# Altium schematic sheet Top Level.SchDoc
size Tabloid; Author: Arash Ghaderi; SheetNumber: 1; SheetTotal: 9; PageSetup: Record=PageOptions|CenterHorizontal=True|CenterVertical=True|PrintScale=1.00|XCorrection=1.00|YCorrection=1.00|PrintKind=1|BorderSize=5000000|LeftOffset=0|BottomOffset=0|Orientation=2|PaperLength=1000|PaperWidth=1000|Scale=100|PaperSource=7|PrintQuality=-4|MediaType=1|DitherType=10|PaperKind=Ledger|PrintScaleMode=1; cpr-ItemNumber: 025619; cpr-ItemName1: TURTLEBOT4  UI Board; cpr-ItemName2: Rev 2; cpr-Revision: 2; cpr-SheetNumber: 1; cpr-SheetTotal: 9; cpr-Draft: XXX; cpr-DraftDate: 19/04/2022; cpr-Rigour1: X; cpr-Rigour2: X; cpr-Rigour1Date: X; cpr-Rigour2Date: X
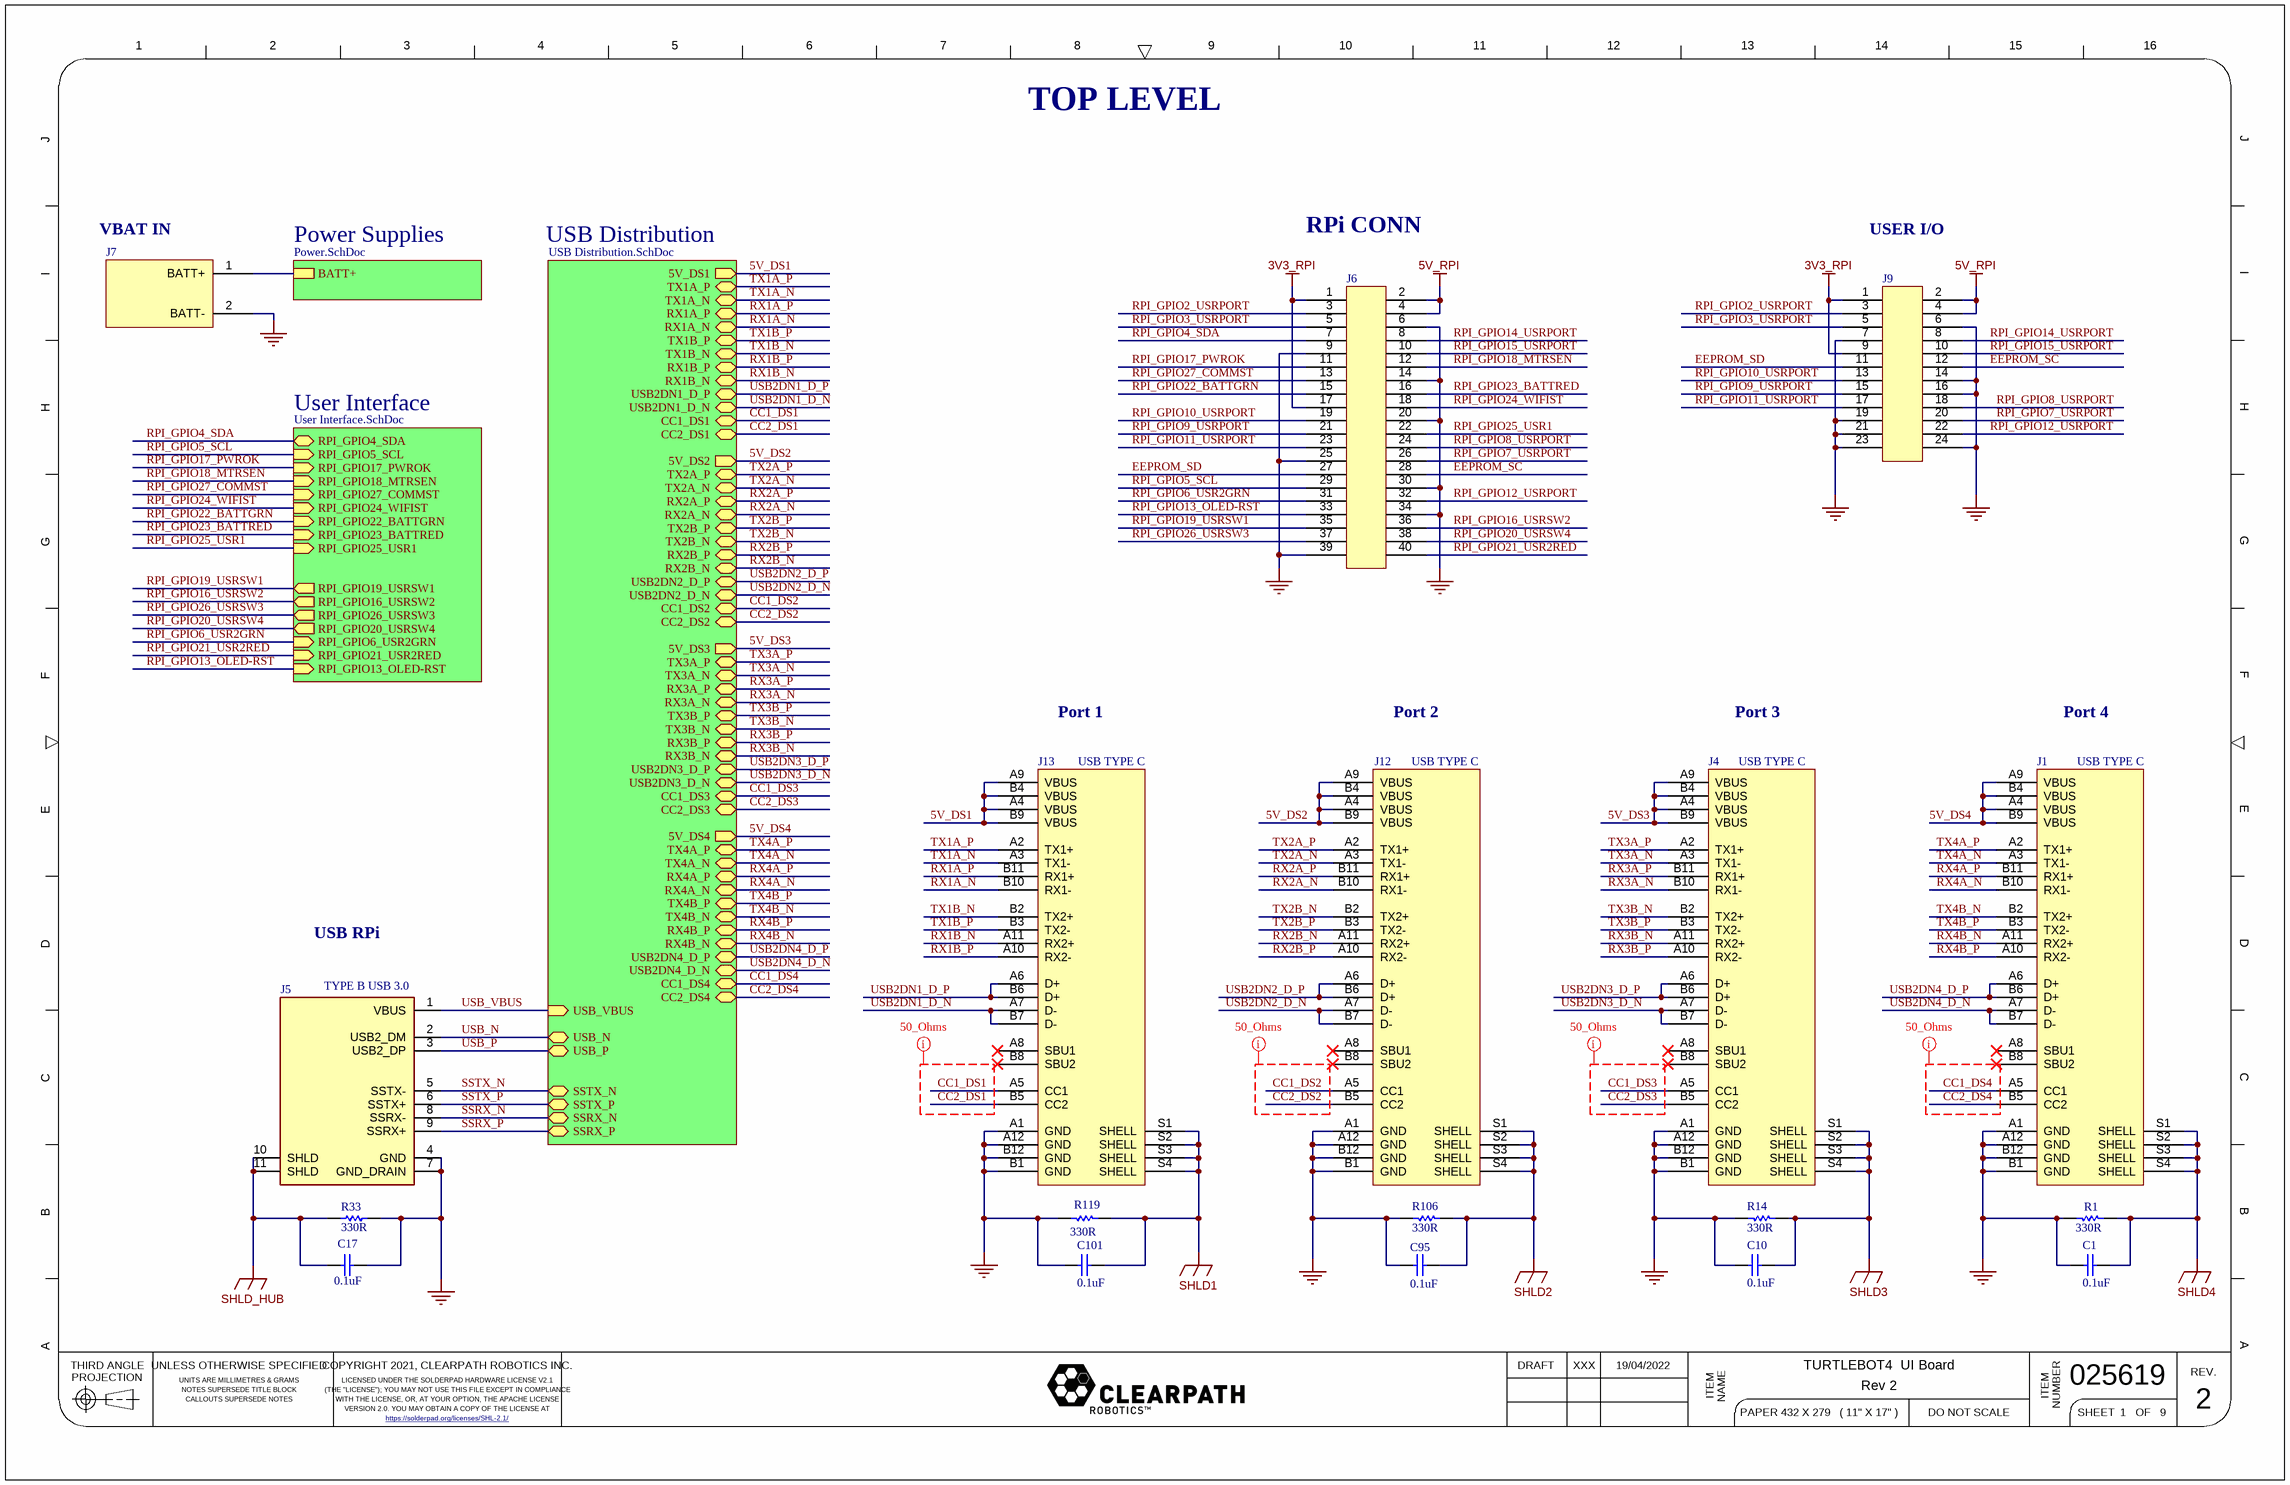
[diagram p0: Top Level.SchDoc]

## Parts
C1  value 0.1uF  [C0805]  (hidden comment: Capacitor _SMT)
C10  value 0.1uF  [C0805]  (hidden comment: Capacitor _SMT)
C17  value 0.1uF  [C0805]  (hidden comment: Capacitor _SMT)
C95  value 0.1uF  [C0805]  (hidden comment: Capacitor _SMT)
C101  value 0.1uF  [C0805]  (hidden comment: Capacitor _SMT)
J1  USB TYPE C  [MOLEX_2012670005]
J4  USB TYPE C  [MOLEX_2012670005]
J5  TYPE B USB 3.0  [1003-024-02000]
J6  Conn_2X20_2  [Conn_2X20_SMT]  (value not drawn)
J7  JST Power Connector  [JST_S2B]  (value not drawn)
J9  AUX_CONNECTOR  [SULLINS_SBH11-NBPC-D12-SM-BK]  (value not drawn)
J12  USB TYPE C  [MOLEX_2012670005]
J13  USB TYPE C  [MOLEX_2012670005]
R1  value 330R  [R0805]  (hidden comment: Resistor_SMT)
R14  value 330R  [R0805]  (hidden comment: Resistor_SMT)
R33  value 330R  [R0805]  (hidden comment: Resistor_SMT)
R106  value 330R  [R0805]  (hidden comment: Resistor_SMT)
R119  value 330R  [R0805]  (hidden comment: Resistor_SMT)

## Sub-sheets
Power Supplies = Power.SchDoc: BATT+
USB Distribution = USB Distribution.SchDoc: RX1A_N (bidir), TX1B_N (bidir), TX1B_P (bidir), CC2_DS1 (bidir), CC1_DS1 (bidir), TX1A_N (bidir), 5V_DS1 (out), TX1A_P (bidir), USB2DN1_D_N (bidir), RX1B_P (bidir), RX1B_N (bidir), RX1A_P (bidir), USB2DN1_D_P (bidir), SSTX_P (bidir), USB_P (bidir), USB_N (bidir), USB_VBUS (in), SSRX_P (bidir), SSRX_N (bidir), SSTX_N (bidir), TX3A_P (bidir), CC1_DS4 (bidir), 5V_DS4 (out), RX2B_N (bidir), TX3B_N (bidir), RX4B_N (bidir), RX2A_N (bidir), USB2DN2_D_P (bidir), USB2DN4_D_N (bidir), RX4A_N (bidir), RX3B_P (bidir), TX4B_N (bidir), RX3A_N (bidir), CC2_DS4 (bidir), TX3A_N (bidir), 5V_DS2 (out), TX4A_P (bidir), RX3B_N (bidir), TX4B_P (bidir), CC2_DS2 (bidir), TX2A_N (bidir), USB2DN3_D_N (bidir), TX4A_N (bidir), RX2B_P (bidir), TX3B_P (bidir), RX4B_P (bidir), TX2B_P (bidir), TX2A_P (bidir), TX2B_N (bidir), USB2DN4_D_P (bidir), 5V_DS3 (out), USB2DN3_D_P (bidir), CC2_DS3 (bidir), RX4A_P (bidir), RX2A_P (bidir), USB2DN2_D_N (bidir), RX3A_P (bidir), CC1_DS3 (bidir), CC1_DS2 (bidir)
User Interface = User Interface.SchDoc: RPI_GPIO27_COMMST (in), RPI_GPIO24_WIFIST (in), RPI_GPIO18_MTRSEN (in), RPI_GPIO5_SCL (in), RPI_GPIO17_PWROK (in), RPI_GPIO23_BATTRED (in), RPI_GPIO20_USRSW4 (out), RPI_GPIO4_SDA (bidir), RPI_GPIO22_BATTGRN (in), RPI_GPIO25_USR1 (in), RPI_GPIO6_USR2GRN (in), RPI_GPIO21_USR2RED (in), RPI_GPIO26_USRSW3 (out), RPI_GPIO16_USRSW2 (out), RPI_GPIO19_USRSW1 (out), RPI_GPIO13_OLED-RST (in)

## Nets
3V3_RPI: J6.1 J6.17 J9.1 J9.9
5V_RPI: J6.2 J6.4 J9.2 J9.4
GND: C1.2 C10.2 C17.2 C95.2 C101.2 J1.A1(GND) J1.A12(GND) J1.B1(GND) J1.B12(GND) J4.A1(GND) J4.A12(GND) J4.B1(GND) J4.B12(GND) J5.4(GND) J5.7(GND_DRAIN) J6.6 J6.9 J6.14 J6.20 J6.25 J6.30 J6.34 J6.39 J7.2(BATT-) J9.6 J9.7 J9.14 J9.16 J9.19 J9.21 J9.23 J9.24 J12.A1(GND) J12.A12(GND) J12.B1(GND) J12.B12(GND) J13.A1(GND) J13.A12(GND) J13.B1(GND) J13.B12(GND) R1.2 R14.2 R33.2 R106.2 R119.2
SHLD1: C101.1 J13.S1(SHELL) J13.S2(SHELL) J13.S3(SHELL) J13.S4(SHELL) R119.1
SHLD2: C95.1 J12.S1(SHELL) J12.S2(SHELL) J12.S3(SHELL) J12.S4(SHELL) R106.1
SHLD3: C10.1 J4.S1(SHELL) J4.S2(SHELL) J4.S3(SHELL) J4.S4(SHELL) R14.1
SHLD4: C1.1 J1.S1(SHELL) J1.S2(SHELL) J1.S3(SHELL) J1.S4(SHELL) R1.1
SHLD_HUB: C17.1 J5.10(SHLD) J5.11(SHLD) R33.1
5V_DS1: J13.A4(VBUS) J13.A9(VBUS) J13.B4(VBUS) J13.B9(VBUS) ; sheet USB Distribution/5V_DS1
5V_DS2: J12.A4(VBUS) J12.A9(VBUS) J12.B4(VBUS) J12.B9(VBUS) ; sheet USB Distribution/5V_DS2
5V_DS3: J4.A4(VBUS) J4.A9(VBUS) J4.B4(VBUS) J4.B9(VBUS) ; sheet USB Distribution/5V_DS3
5V_DS4: J1.A4(VBUS) J1.A9(VBUS) J1.B4(VBUS) J1.B9(VBUS) ; sheet USB Distribution/5V_DS4
CC1_DS1: J13.A5(CC1) ; sheet USB Distribution/CC1_DS1
CC1_DS2: J12.A5(CC1) ; sheet USB Distribution/CC1_DS2
CC1_DS3: J4.A5(CC1) ; sheet USB Distribution/CC1_DS3
CC1_DS4: J1.A5(CC1) ; sheet USB Distribution/CC1_DS4
CC2_DS1: J13.B5(CC2) ; sheet USB Distribution/CC2_DS1
CC2_DS2: J12.B5(CC2) ; sheet USB Distribution/CC2_DS2
CC2_DS3: J4.B5(CC2) ; sheet USB Distribution/CC2_DS3
CC2_DS4: J1.B5(CC2) ; sheet USB Distribution/CC2_DS4
EEPROM_SC: J6.28 J9.12
EEPROM_SD: J6.27 J9.11
RPI_GPIO2_USRPORT: J6.3 J9.3
RPI_GPIO3_USRPORT: J6.5 J9.5
RPI_GPIO4_SDA: J6.7 ; sheet User Interface/RPI_GPIO4_SDA
RPI_GPIO5_SCL: J6.29 ; sheet User Interface/RPI_GPIO5_SCL
RPI_GPIO6_USR2GRN: J6.31 ; sheet User Interface/RPI_GPIO6_USR2GRN
RPI_GPIO7_USRPORT: J6.26 J9.20
RPI_GPIO8_USRPORT: J6.24 J9.18
RPI_GPIO9_USRPORT: J6.21 J9.15
RPI_GPIO10_USRPORT: J6.19 J9.13
RPI_GPIO11_USRPORT: J6.23 J9.17
RPI_GPIO12_USRPORT: J6.32 J9.22
RPI_GPIO13_OLED-RST: J6.33 ; sheet User Interface/RPI_GPIO13_OLED-RST
RPI_GPIO14_USRPORT: J6.8 J9.8
RPI_GPIO15_USRPORT: J6.10 J9.10
RPI_GPIO16_USRSW2: J6.36 ; sheet User Interface/RPI_GPIO16_USRSW2
RPI_GPIO17_PWROK: J6.11 ; sheet User Interface/RPI_GPIO17_PWROK
RPI_GPIO18_MTRSEN: J6.12 ; sheet User Interface/RPI_GPIO18_MTRSEN
RPI_GPIO19_USRSW1: J6.35 ; sheet User Interface/RPI_GPIO19_USRSW1
RPI_GPIO20_USRSW4: J6.38 ; sheet User Interface/RPI_GPIO20_USRSW4
RPI_GPIO21_USR2RED: J6.40 ; sheet User Interface/RPI_GPIO21_USR2RED
RPI_GPIO22_BATTGRN: J6.15 ; sheet User Interface/RPI_GPIO22_BATTGRN
RPI_GPIO23_BATTRED: J6.16 ; sheet User Interface/RPI_GPIO23_BATTRED
RPI_GPIO24_WIFIST: J6.18 ; sheet User Interface/RPI_GPIO24_WIFIST
RPI_GPIO25_USR1: J6.22 ; sheet User Interface/RPI_GPIO25_USR1
RPI_GPIO26_USRSW3: J6.37 ; sheet User Interface/RPI_GPIO26_USRSW3
RPI_GPIO27_COMMST: J6.13 ; sheet User Interface/RPI_GPIO27_COMMST
RX1A_N: J13.B10(RX1-) ; sheet USB Distribution/RX1A_N
RX1A_P: J13.B11(RX1+) ; sheet USB Distribution/RX1A_P
RX1B_N: J13.A11(RX2+) ; sheet USB Distribution/RX1B_N
RX1B_P: J13.A10(RX2-) ; sheet USB Distribution/RX1B_P
RX2A_N: J12.B10(RX1-) ; sheet USB Distribution/RX2A_N
RX2A_P: J12.B11(RX1+) ; sheet USB Distribution/RX2A_P
RX2B_N: J12.A11(RX2+) ; sheet USB Distribution/RX2B_N
RX2B_P: J12.A10(RX2-) ; sheet USB Distribution/RX2B_P
RX3A_N: J4.B10(RX1-) ; sheet USB Distribution/RX3A_N
RX3A_P: J4.B11(RX1+) ; sheet USB Distribution/RX3A_P
RX3B_N: J4.A11(RX2+) ; sheet USB Distribution/RX3B_N
RX3B_P: J4.A10(RX2-) ; sheet USB Distribution/RX3B_P
RX4A_N: J1.B10(RX1-) ; sheet USB Distribution/RX4A_N
RX4A_P: J1.B11(RX1+) ; sheet USB Distribution/RX4A_P
RX4B_N: J1.A11(RX2+) ; sheet USB Distribution/RX4B_N
RX4B_P: J1.A10(RX2-) ; sheet USB Distribution/RX4B_P
SSRX_N: J5.8(SSRX-) ; sheet USB Distribution/SSRX_N
SSRX_P: J5.9(SSRX+) ; sheet USB Distribution/SSRX_P
SSTX_N: J5.5(SSTX-) ; sheet USB Distribution/SSTX_N
SSTX_P: J5.6(SSTX+) ; sheet USB Distribution/SSTX_P
TX1A_N: J13.A3(TX1-) ; sheet USB Distribution/TX1A_N
TX1A_P: J13.A2(TX1+) ; sheet USB Distribution/TX1A_P
TX1B_N: J13.B2(TX2+) ; sheet USB Distribution/TX1B_N
TX1B_P: J13.B3(TX2-) ; sheet USB Distribution/TX1B_P
TX2A_N: J12.A3(TX1-) ; sheet USB Distribution/TX2A_N
TX2A_P: J12.A2(TX1+) ; sheet USB Distribution/TX2A_P
TX2B_N: J12.B2(TX2+) ; sheet USB Distribution/TX2B_N
TX2B_P: J12.B3(TX2-) ; sheet USB Distribution/TX2B_P
TX3A_N: J4.A3(TX1-) ; sheet USB Distribution/TX3A_N
TX3A_P: J4.A2(TX1+) ; sheet USB Distribution/TX3A_P
TX3B_N: J4.B2(TX2+) ; sheet USB Distribution/TX3B_N
TX3B_P: J4.B3(TX2-) ; sheet USB Distribution/TX3B_P
TX4A_N: J1.A3(TX1-) ; sheet USB Distribution/TX4A_N
TX4A_P: J1.A2(TX1+) ; sheet USB Distribution/TX4A_P
TX4B_N: J1.B2(TX2+) ; sheet USB Distribution/TX4B_N
TX4B_P: J1.B3(TX2-) ; sheet USB Distribution/TX4B_P
USB2DN1_D_N: J13.A7(D-) J13.B7(D-) ; sheet USB Distribution/USB2DN1_D_N
USB2DN1_D_P: J13.A6(D+) J13.B6(D+) ; sheet USB Distribution/USB2DN1_D_P
USB2DN2_D_N: J12.A7(D-) J12.B7(D-) ; sheet USB Distribution/USB2DN2_D_N
USB2DN2_D_P: J12.A6(D+) J12.B6(D+) ; sheet USB Distribution/USB2DN2_D_P
USB2DN3_D_N: J4.A7(D-) J4.B7(D-) ; sheet USB Distribution/USB2DN3_D_N
USB2DN3_D_P: J4.A6(D+) J4.B6(D+) ; sheet USB Distribution/USB2DN3_D_P
USB2DN4_D_N: J1.A7(D-) J1.B7(D-) ; sheet USB Distribution/USB2DN4_D_N
USB2DN4_D_P: J1.A6(D+) J1.B6(D+) ; sheet USB Distribution/USB2DN4_D_P
USB_N: J5.2(USB2_DM) ; sheet USB Distribution/USB_N
USB_P: J5.3(USB2_DP) ; sheet USB Distribution/USB_P
USB_VBUS: J5.1(VBUS) ; sheet USB Distribution/USB_VBUS
NetJ7_1: J7.1(BATT+) ; sheet Power Supplies/BATT+

Not connected (* = marked no-connect by the designer): J1 A8(SBU1)* B8(SBU2)*; J4 A8(SBU1)* B8(SBU2)*; J12 A8(SBU1)* B8(SBU2)*; J13 A8(SBU1)* B8(SBU2)*

## Layout directives
net class 50_Ohms; rule Width Constraint [Pref Width = 7mil    Min Width = 7mil    Max Width = 7mil]: CC1_DS1, CC1_DS2, CC1_DS3, CC1_DS4, CC2_DS1, CC2_DS2, CC2_DS3, CC2_DS4

## Notes on the sheet
- TOP LEVEL
- VBAT IN
- RPi CONN
- USER I/O
- Port 1
- Port 2
- Port 3
- Port 4
- USB RPi
- 1
- 2
- 3
- 4
- 5
- 6
- 7
- 8
- 9
- 10
- 11
- 12
- 13
- 14
- 15
- 16
- J
- I
- H
- G
- F
- E
- D
- C
- B
- A
- THIRD ANGLE
- PROJECTION
- UNLESS OTHERWISE SPECIFIED
- COPYRIGHT 2021, CLEARPATH ROBOTICS INC.
- DRAFT
- REV.
- UNITS ARE MILLIMETRES & GRAMS
- NOTES SUPERSEDE TITLE BLOCK
- CALLOUTS SUPERSEDE NOTES
- LICENSED UNDER THE SOLDERPAD HARDWARE LICENSE V2.1
- (THE "LICENSE"); YOU MAY NOT USE THIS FILE EXCEPT IN COMPLIANCE
- WITH THE LICENSE, OR, AT YOUR OPTION, THE APACHE LICENSE
- VERSION 2.0. YOU MAY OBTAIN A COPY OF THE LICENSE AT
- https://solderpad.org/licenses/SHL-2.1/ <https://solderpad.https://solderpad.org/licenses/SHL-2.1/org/licenses/SHL-2.1/>
- ITEM
- NAME
- PAPER 432 X 279   ( 11" X 17" )
- DO NOT SCALE
- NUMBER
- SHEET
- OF

## Library data of the parts
C1 C10 C17 C95 C101 = Capacitor _SMT: Capacitor; Tolerance: 10%; Voltage: 50V; Vendor: Digikey; Vendor PN: 311-1140-1-ND; Mfg: Yageo; Mfg PN: CC0805KRX7R9BB104; DNP: *; Package: 0805
J1 J4 J12 J13 = Molex_2012670005: USB Type C receptacle; Vendor: Digikey; Vendor PN: WM17992CT-ND; Mfg: Molex; Mfg PN: 2012670005
J5 = CNC_1003-024-02000: CNC RA USB3.0 Type B; Mfg: CNC Tech; Vendor 1: Digikey; Vendor 1 PN: 1175-1271-ND; Mfg PN: 1003-024-02000
J6 = Conn_2X20_2: sourface mount. 2X20 pin connector meant to connect to ribbon cable; Supplier 1: Digi-Key; Supplier Part Number 1: S9192-ND
J7 = JST_S2B-XH-A(LF)(SN): JST S2B-XH-A(LF)(SN); Vendor: Digikey; Vendor PN: 455-2257-ND; Manufacturer: JST; Mfg PN: S2B-XH-A(LF)(SN)
J9 = Conn_2X12_THU: Supplier 1: Digi-Key; Supplier Part Number 1: S9189-ND
R1 R14 R33 R106 R119 = Resistor_SMT: Resistor; Vendor: Digikey; Vendor PN: 311-330ARCT-ND; Tolerance: 5%; Mfg: Yageo; Mfg PN: RC0805JR-07330RL; Power Rating: *; Package: 0805